# EasyEDA schematic SCH_heart_2024-08-19 (1).json
TITLE: Sheet_2; REV: 1.0; Date: 2024-08-19; Sheet: 1/1; Drawn By: anirudh_sahu_12; Company: Your Company
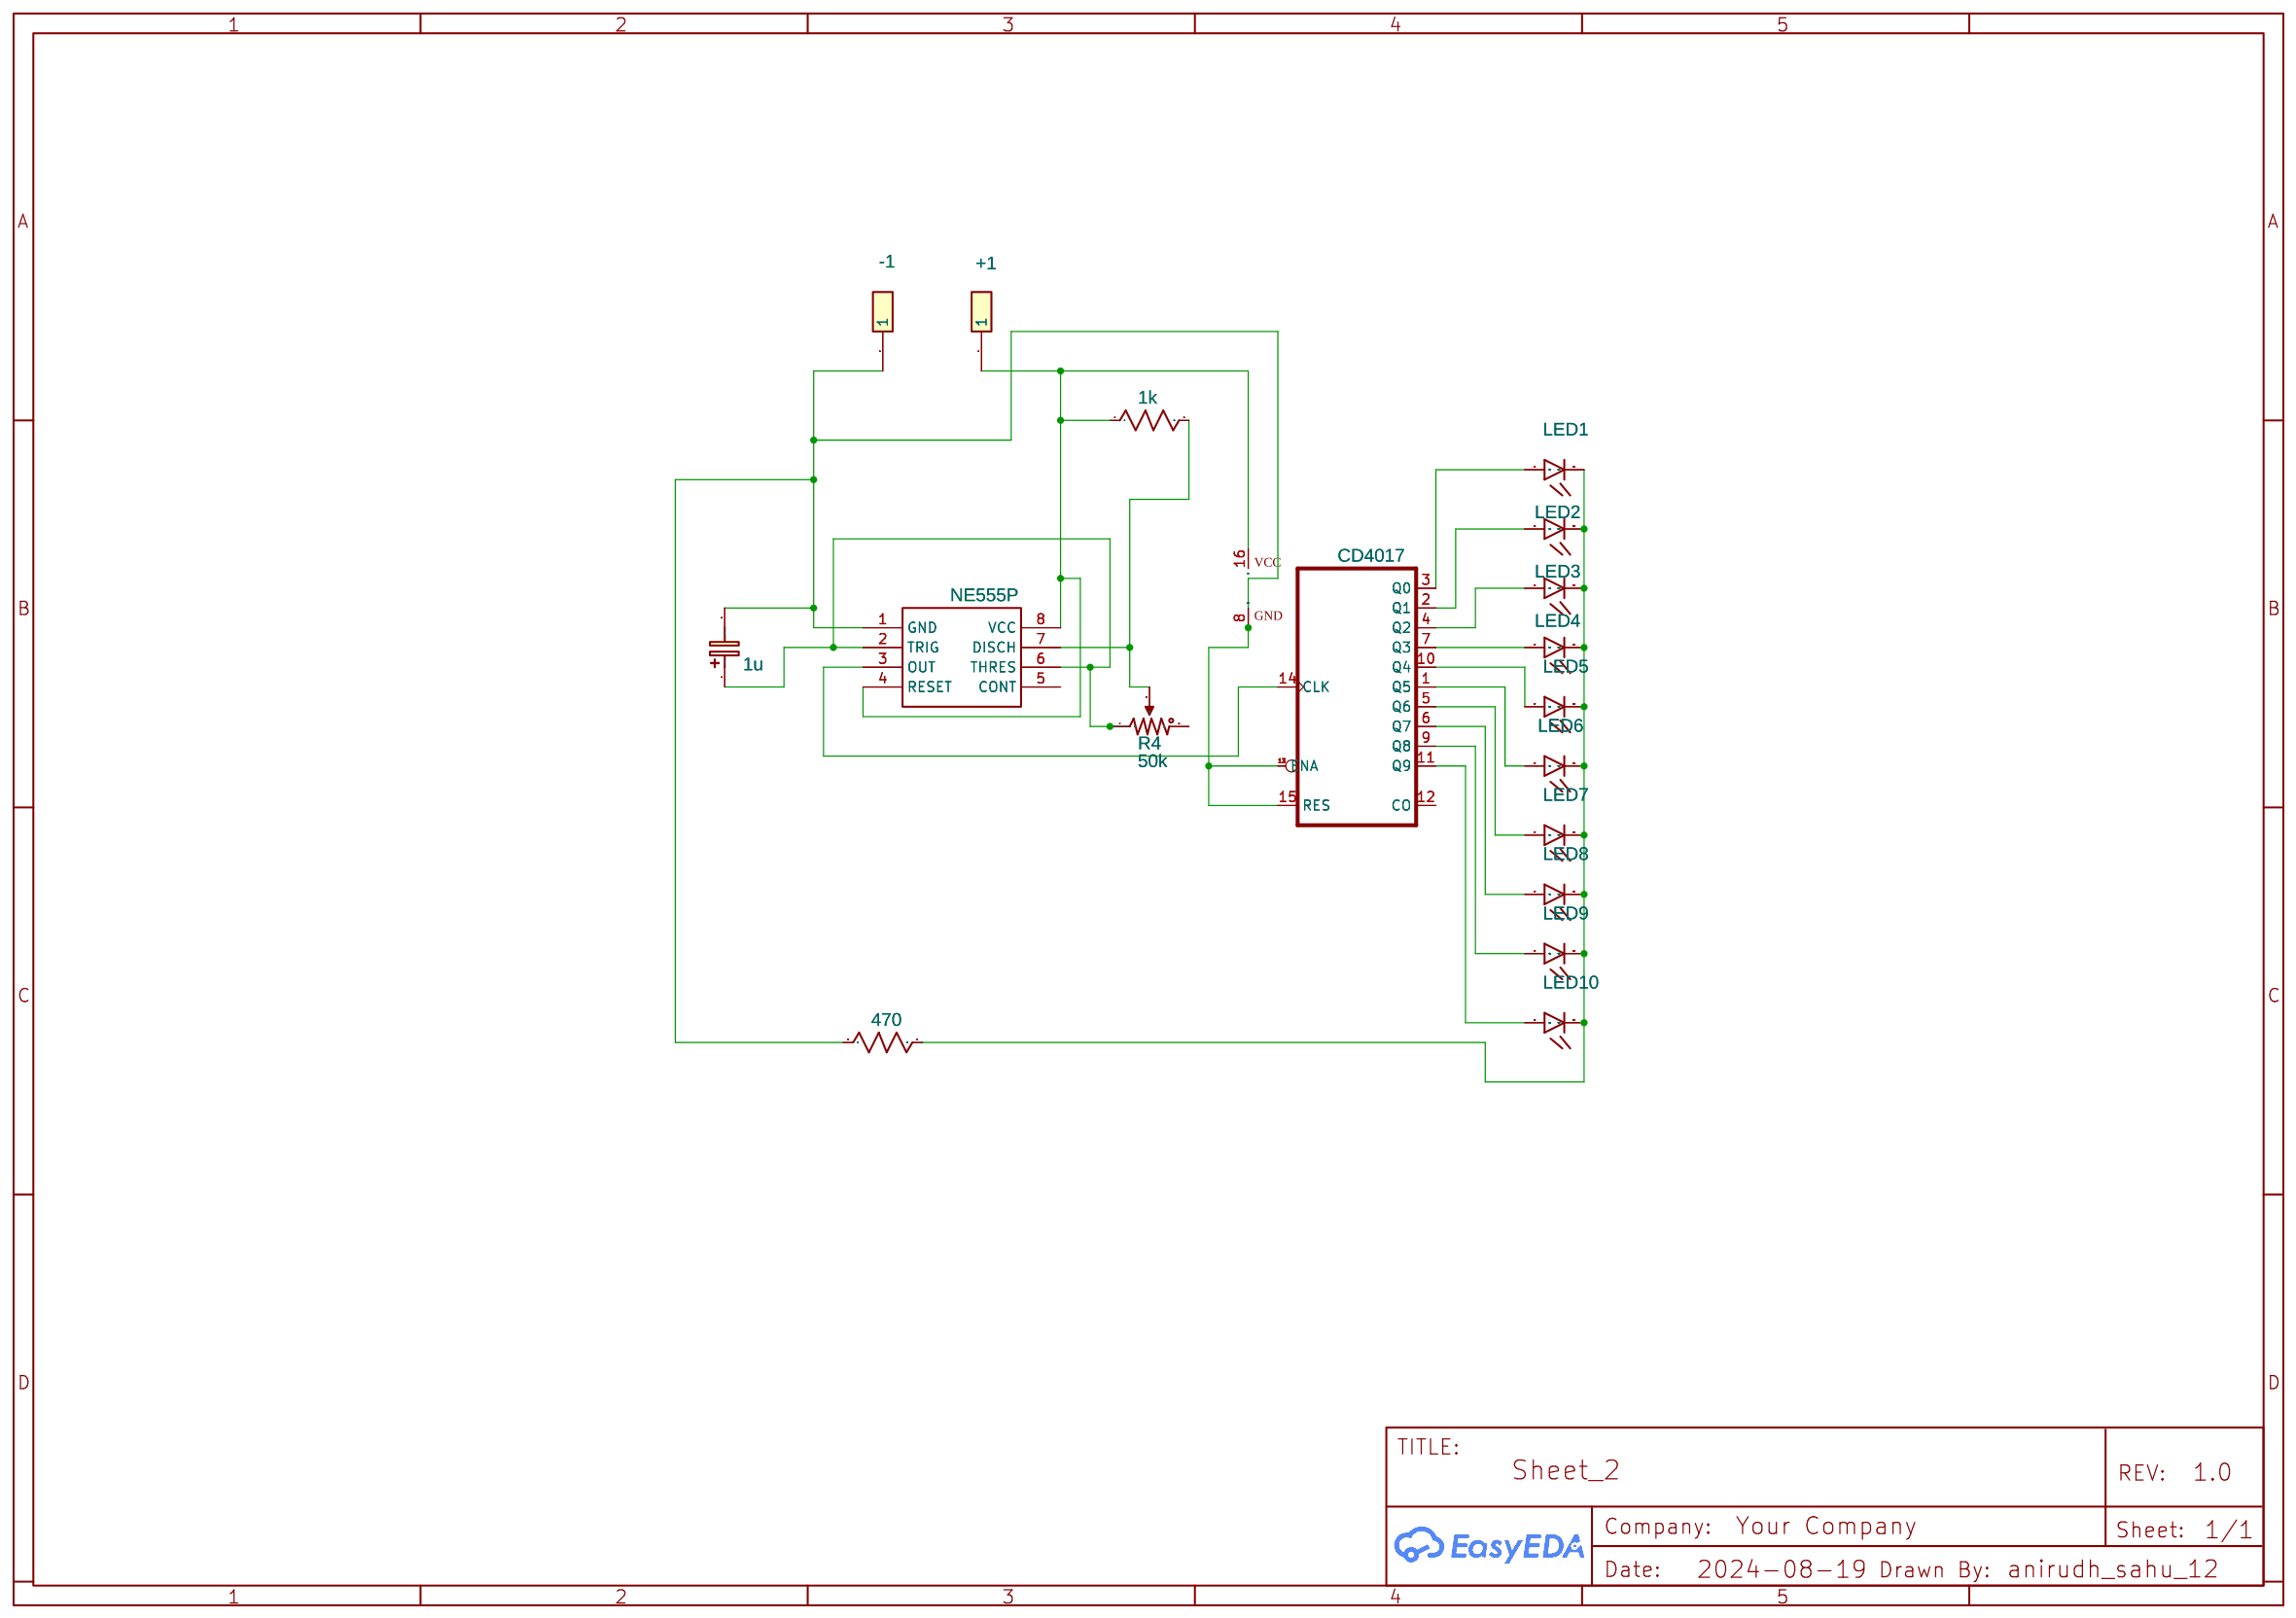
[diagram p0: schematic sheet]

## Parts
+1  Header-Male-2.54_1x1  [HDR-1X1/2.54]
-1  Header-Male-2.54_1x1  [HDR-1X1/2.54]
C1  1u  [CAP-D3.0XF1.5]
LED1  LED 1  [LED5]
LED2  LED 2  [LED5]
LED3  LED 3  [LED5]
LED4  LED 4  [LED5]
LED5  LED 5  [LED5]
LED6  LED 6  [LED5]
LED7  LED 7  [LED5]
LED8  LED 8  [LED5]
LED9  LED 9  [LED5]
LED10  LED 10  [LED5]
R2  1k  [AXIAL-0.3]
R3  470  [AXIAL-0.3]
R4  50k  [RES-ADJ_3296X]
U1  CD4017  [DIL16]  (section 2)
U2  NE555P  [DIP-8]
U3  CD4017  [DIL16-KIT]  (section 1)

## Library data of the parts
+1 -1 = -: Supplier: LCSC; Manufacturer: LCSC; Supplier Part: C81276
C1 = Capacitor: Manufacturer Part: ?
LED1-LED10 = -: catid: 20; Manufacturer Part: ?
R2 R3 = Resistor: Manufacturer Part: ?
R4 = Potentiometer: K(%): 50; Manufacturer Part: ?
U1 U3 = -: catid: 20; Contributor: SparkFun; Manufacturer Part: ?
U2 = -: Contributor: dillon; Supplier: LCSC; Manufacturer: TI; Supplier Part: C46749

## Nets
Net-(+1-1): +1.1 R2.1 U1.16(VCC) U2.4(RESET) U2.8(VCC)
Net-(-1-1): -1.1 C1.2 R3.1 U1.8(GND) U2.1(GND) U3.13(ENA) U3.15(RES)
Net-(C1-1): C1.1 R4.1 U2.2(TRIG) U2.6(THRES)
Net-(LED1-ANODE): LED1.ANODE U3.3(Q0)
Net-(LED1-CATHODE): LED1.CATHODE LED2.CATHODE LED3.CATHODE LED4.CATHODE LED5.CATHODE LED6.CATHODE LED7.CATHODE LED8.CATHODE LED9.CATHODE LED10.CATHODE R3.2
Net-(LED2-ANODE): LED2.ANODE U3.2(Q1)
Net-(LED3-ANODE): LED3.ANODE U3.4(Q2)
Net-(LED4-ANODE): LED4.ANODE U3.7(Q3)
Net-(LED5-ANODE): LED5.ANODE U3.10(Q4)
Net-(LED6-ANODE): LED6.ANODE U3.1(Q5)
Net-(LED7-ANODE): LED7.ANODE U3.5(Q6)
Net-(LED8-ANODE): LED8.ANODE U3.6(Q7)
Net-(LED9-ANODE): LED9.ANODE U3.9(Q8)
Net-(LED10-ANODE): LED10.ANODE U3.11(Q9)
Net-(R2-2): R2.2 R4.2(3) U2.7(DISCH)
Net-(U2-3): U2.3(OUT) U3.14(CLK)

Not connected (* = marked no-connect by the designer): R4 3(2); U2 5(CONT); U3 12(CO)
